# EAGLE design GrovePi-1.5 (EAGLE 6.3)
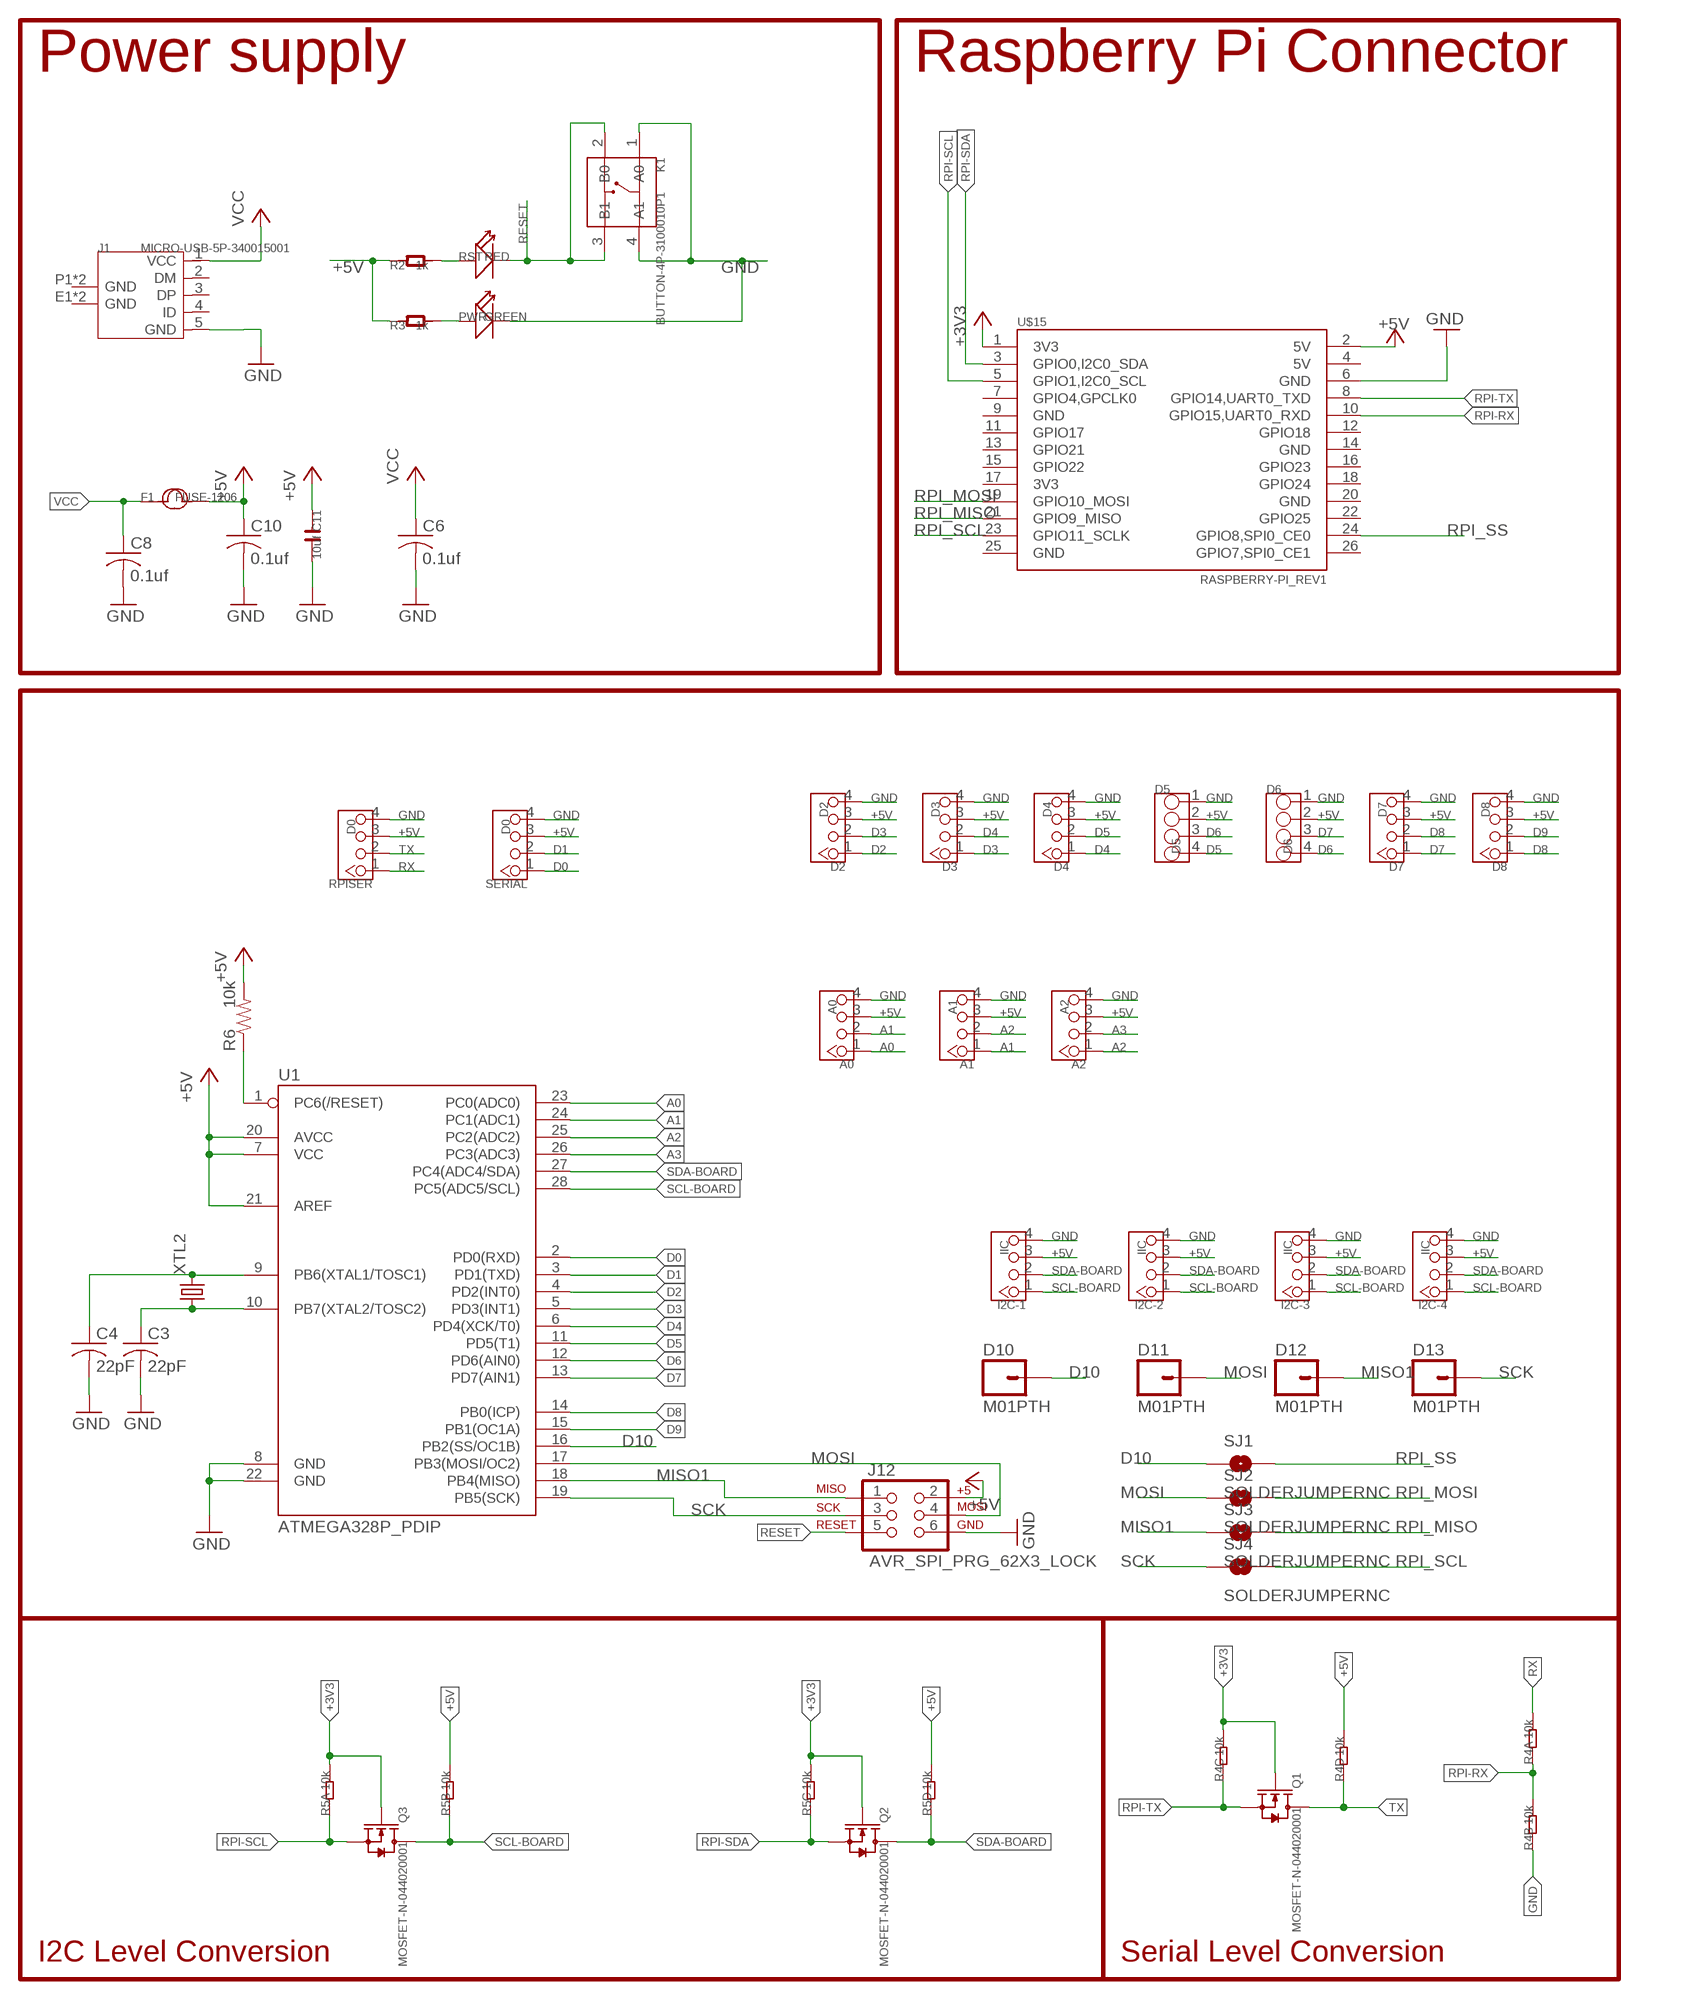
[diagram p0: schematic, sheet 1]

## Parts
A0  A0  TWIG-4P-2.0'90D'  [4P-2.0-90D]
A1  A1  TWIG-4P-2.0'90D'  [4P-2.0-90D]
A2  A2  TWIG-4P-2.0'90D'  [4P-2.0-90D]
C3  22pF  C-USC0603  [C0603]
C4  22pF  C-USC0603  [C0603]
C6  0.1uf  C-USC0603  [C0603]
C8  0.1uf  C-USC0603  [C0603]
C10  0.1uf  C-USC0603  [C0603]
C11  10uf  C-0805  [C0805]
D2  D2  TWIG-4P-2.0'90D'  [4P-2.0-90D]
D3  D3  TWIG-4P-2.0'90D'  [4P-2.0-90D]
D4  D4  TWIG-4P-2.0'90D'  [4P-2.0-90D]
D5  D5  GROVE-4P-2.0-3470130P1  [4P-2.0]
D6  D6  GROVE-4P-2.0-3470130P1  [4P-2.0]
D7  D7  TWIG-4P-2.0'90D'  [4P-2.0-90D]
D8  D8  TWIG-4P-2.0'90D'  [4P-2.0-90D]
D10  M01PTH  [1X01]
D11  M01PTH  [1X01]
D12  M01PTH  [1X01]
D13  M01PTH  [1X01]
F1  FUSE-1206  [F1206]
I2C-1  IIC  TWIG-4P-2.0'90D'  [4P-2.0-90D]
I2C-2  IIC  TWIG-4P-2.0'90D'  [4P-2.0-90D]
I2C-3  IIC  TWIG-4P-2.0'90D'  [4P-2.0-90D]
I2C-4  IIC  TWIG-4P-2.0'90D'  [4P-2.0-90D]
J1  MICRO-USB-5P-340015001  [B-SMD-5P]
J12  AVR_SPI_PRG_62X3_LOCK  [2X3_LOCK]
K1  BUTTON-4P-3100010P1  [4P-SMD-6.0X6.0X5.0H]
PWR  GREEN  LED  [LED0603]
Q1  MOSFET-N-044020001  [SOT23]
Q2  MOSFET-N-044020001  [SOT23]
Q3  MOSFET-N-044020001  [SOT23]
R2  1k  R-0603  [R0603]
R3  1k  R-0603  [R0603]
R4  10k  R-4R  [R1206-8]
R5  10k  R-4R  [R1206-8]
R6  10k  RESISTOR0603-RES  [0603]
RPISER  D0  TWIG-4P-2.0'90D'  [4P-2.0-90D]
RST  RED  LED  [LED0603]
SERIAL  D0  TWIG-4P-2.0'90D'  [4P-2.0-90D]
SJ1  SOLDERJUMPERNC  [SJ_2S]
SJ2  SOLDERJUMPERNC  [SJ_2S]
SJ3  SOLDERJUMPERNC  [SJ_2S]
SJ4  SOLDERJUMPERNC  [SJ_2S]
U1  ATMEGA328P_PDIP  [DIL28-3]
U$15  RASPBERRY-PI_REV1  [RASPBERRY-PI_REV1]
XTL2  CRYSTALHC49S  [HC49/S]

## Nets
+3V3: Q1.1(G) Q2.1(G) Q3.1(G) R4.6 R5.6 R5.8 U$15.1(3V3)
+5V: A0.3 A1.3 A2.3 C6.1 C10.1 C11.1 D2.3 D3.3 D4.3 D5.3 D6.3 D7.3 D8.3 F1.2 I2C-1.3 I2C-2.3 I2C-3.3 I2C-4.3 J12.2 R2.1 R3.1 R4.5 R5.5 R5.7 R6.2 RPISER.3 SERIAL.3 U1.7(VCC) U1.20(AVCC) U1.21(AREF) U$15.2(5V) ; supply symbol labelled VCC
A0: A0.1 U1.23(PC0(ADC0))
A1: A0.2 A1.1 U1.24(PC1(ADC1))
A2: A1.2 A2.1 U1.25(PC2(ADC2))
A3: A2.2 U1.26(PC3(ADC3))
D0: SERIAL.1 U1.2(PD0(RXD))
D1: SERIAL.2 U1.3(PD1(TXD))
D2: D2.1 U1.4(PD2(INT0))
D3: D2.2 D3.1 U1.5(PD3(INT1))
D4: D3.2 D4.1 U1.6(PD4(XCK/T0))
D5: D4.2 D5.1 U1.11(PD5(T1))
D6: D5.2 D6.1 U1.12(PD6(AIN0))
D7: D6.2 D7.1 U1.13(PD7(AIN1))
D8: D7.2 D8.1 U1.14(PB0(ICP))
D9: D8.2 U1.15(PB1(OC1A))
D10: D10.1 SJ1.1 U1.16(PB2(SS/OC1B))
GND: A0.4 A1.4 A2.4 C3.2 C4.2 C6.2 C8.2 C10.2 C11.2 D2.4 D3.4 D4.4 D5.4 D6.4 D7.4 D8.4 I2C-1.4 I2C-2.4 I2C-3.4 I2C-4.4 J1.5(GND) J12.6 K1.1(A0) K1.4(A1) PWR.- R4.2 RPISER.4 SERIAL.4 U1.8(GND) U1.22(GND) U$15.6(GND)
MISO1: D12.1 J12.1 SJ3.1 U1.18(PB4(MISO))
MOSI: D11.1 J12.4 SJ2.1 U1.17(PB3(MOSI/OC2))
N$1: C4.1 U1.9(PB6(XTAL1/TOSC1)) XTL2.2
N$2: PWR.+ R3.2
N$3: C3.1 U1.10(PB7(XTAL2/TOSC2)) XTL2.1
N$17: R2.2 RST.+
RESET: J12.5 K1.2(B0) K1.3(B1) R6.1 RST.- U1.1(PC6(/RESET))
RPI-RX: R4.1 R4.7 U$15.10(GPIO15,UART0_RXD)
RPI-SCL: Q3.2(S) R5.1 U$15.5(GPIO1,I2C0_SCL)
RPI-SDA: Q2.2(S) R5.3 U$15.3(GPIO0,I2C0_SDA)
RPI-TX: Q1.2(S) R4.3 U$15.8(GPIO14,UART0_TXD)
RPI_MISO: SJ3.2 U$15.21(GPIO9_MISO)
RPI_MOSI: SJ2.2 U$15.19(GPIO10_MOSI)
RPI_SCL: SJ4.2 U$15.23(GPIO11_SCLK)
RPI_SS: SJ1.2 U$15.24(GPIO8,SPI0_CE0)
RX: R4.8 RPISER.1
SCK: D13.1 J12.3 SJ4.1 U1.19(PB5(SCK))
SCL-BOARD: I2C-1.1 I2C-2.1 I2C-3.1 I2C-4.1 Q3.3(D) R5.2 U1.28(PC5(ADC5/SCL))
SDA-BOARD: I2C-1.2 I2C-2.2 I2C-3.2 I2C-4.2 Q2.3(D) R5.4 U1.27(PC4(ADC4/SDA))
TX: Q1.3(D) R4.4 RPISER.2
VCC: C8.1 F1.1 J1.1(VCC)
Unconnected: J1.2(DM) J1.3(DP) J1.4(ID) J1.E1(GND) J1.E2(GND) J1.P1(GND) J1.P2(GND) U$15.4(5V) U$15.7(GPIO4,GPCLK0) U$15.9(GND) U$15.11(GPIO17) U$15.12(GPIO18) U$15.13(GPIO21) U$15.14(GND) U$15.15(GPIO22) U$15.16(GPIO23) U$15.17(3V3) U$15.18(GPIO24) U$15.20(GND) U$15.22(GPIO25) U$15.25(GND) U$15.26(GPIO7,SPI0_CE1)

## Notes on the sheet
- Power supply | Raspberry Pi Connector
- I2C Level Conversion | Serial Level Conversion

## Library data of the parts
A0 A1 A2 D2-D4 D7 D8 I2C-1-I2C-4 RPISER SERIAL = Connector:TWIG-4P-2.0
C3 C4 C6 C8 C10 = rcl:C-US: CAPACITOR, American symbol
C11 = OPL:C*
D5 D6 = OPL Eagle Library:GROVE-4P-2.0
D10-D13 = SparkFun-Connectors:M01: Header 1 Standard 1-pin 0.1" header. Use with straight break away headers (SKU : PRT-00116), right angle break away headers (PRT-00553), swiss pins (PRT-00743), machine pins (PRT-00117), and female headers (PRT-00115).
F1 = OPL:FUSE*
J1 = OPL:MICRO-USB-5P: ST-USB-001E：MICRO USB B SMD R/A
J12 = zz My Parts:AVR_SPI_PRG_6: AVR ISP 6 Pin This is the reduced ISP connector for AVR programming. Common on Arduino. This footprint will take up less PCB space and can be used with a 10-pin to 6-pin adapter such as SKU: BOB-08508
K1 = OPL Eagle Library:BUTTON-4P
PWR RST = OPL:LED*: LED
Q1-Q3 = OPL:MOSFET-N: CJ2302：SMD MOSFET N-CH 20V-2.1A
R2 R3 = OPL:R*
R4 R5 = OPL:R-4R*: Resistor Array
R6 = zz My Parts:RESISTOR: Resistor Basic schematic elements and footprints for resistors. 0603 and 0805 are mine.
SJ1-SJ4 = SparkFun-Passives:SOLDERJUMPER: Solder Jumper Standard SMD solder jumper. Used to automate production. Two varients : Normally Open and Normally Closed are the same, but have different paste layers. NC will have a large amount of paste and should jumper during reflow.
U1 = SparkFun-DigitalIC:ATMEGA328P_PDIP: uC used in the Arduino 32kb flash, 1k EEPROM, 2k SRAM This is the through-hole version of this chip.
U$15 = RaspberryPi:RASPBERRY-PI_REV1: Raspberry Pi Board <http://www.raspberrypi.org/> Jacques Lagnel V1.0 (beta) 2012 Mateusz Bawaj V1.1 (beta) 2012 Board dimension: Forum 3D model <http://www.raspberrypi.org/forum/general-discussion/mechanical-profile-3d-models?value=3d%20model&type=1&include=1&search=1&ret=all> The GPIO Connector (P1): http://elinux.org/RPi_Low-level_peripherals
XTL2 = crystal:CRYSTAL: CRYSTAL; OC_FARNELL: 1667008; OC_NEWARK: unknown

## Board
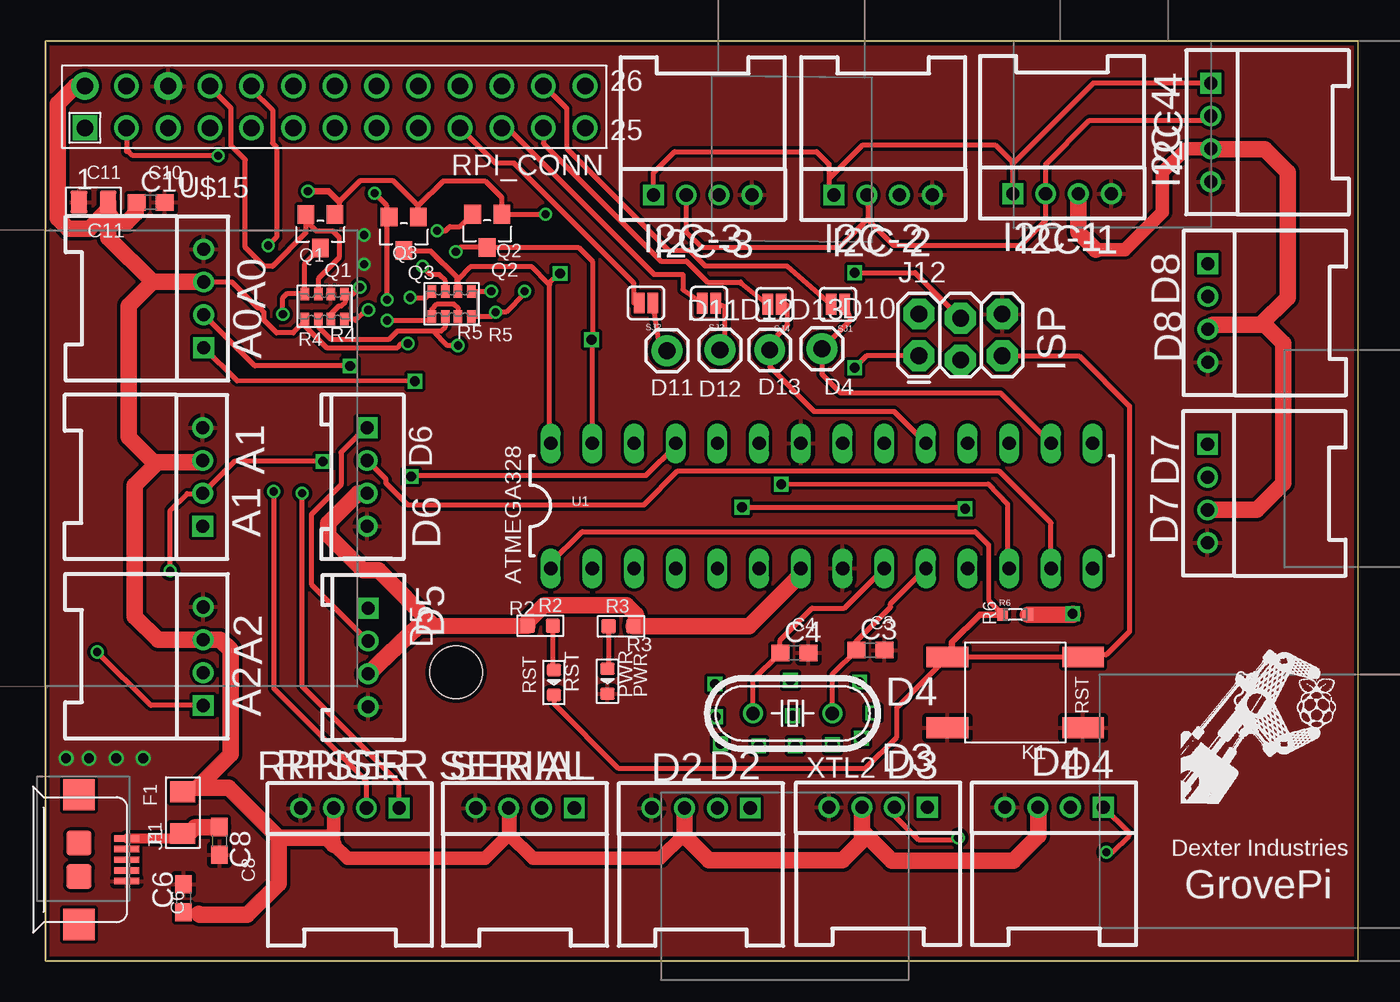
[diagram p1: board, top side]
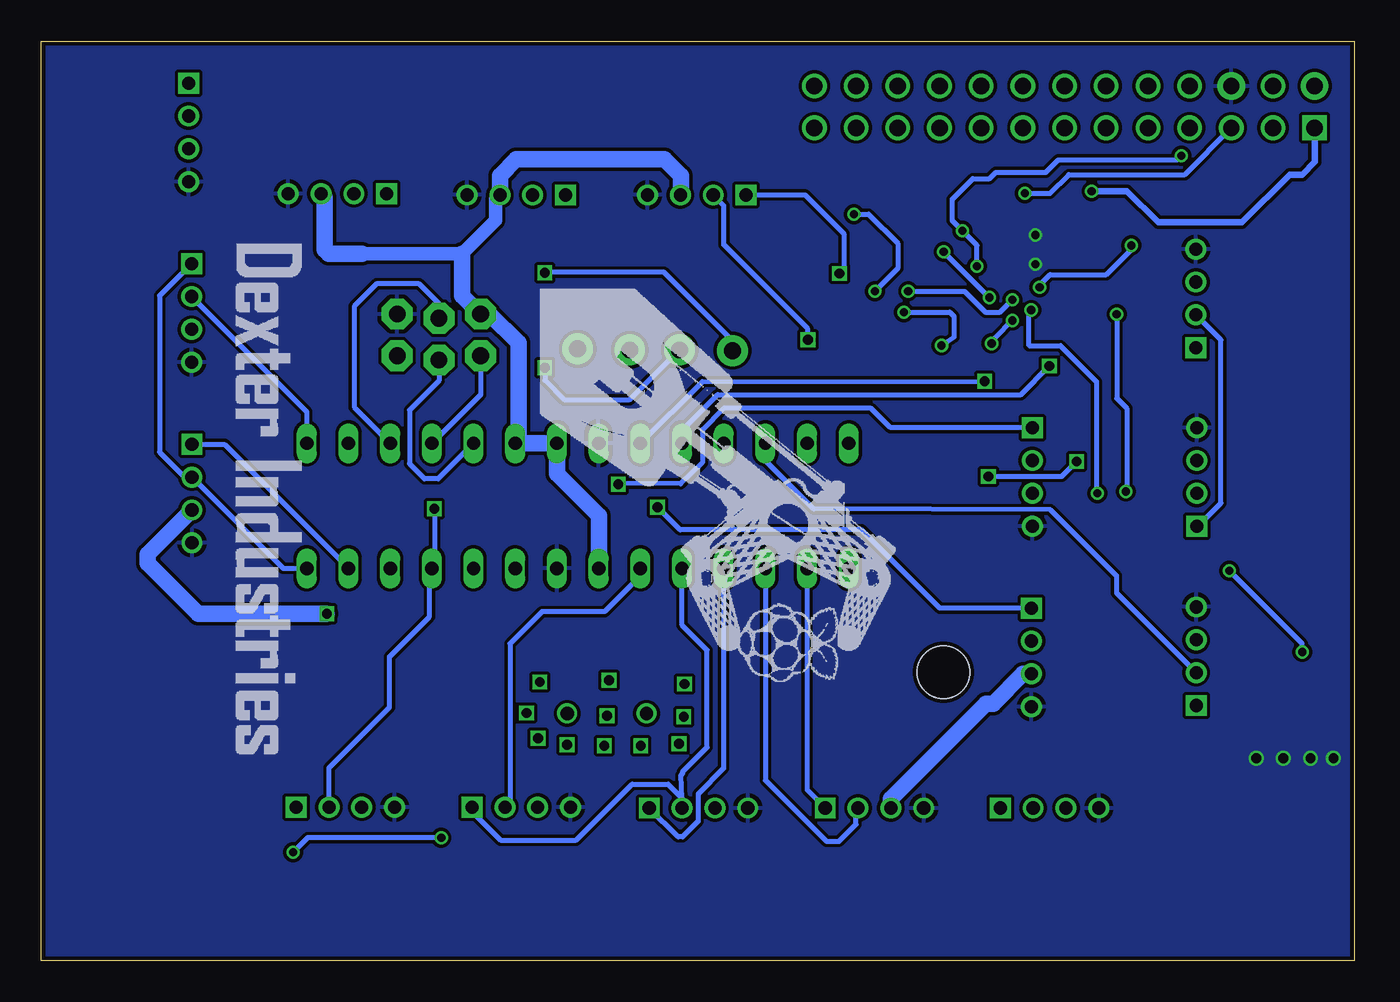
[diagram p2: board, bottom side, seen from below]

Size 80.01 x 56.01 mm. Coordinates in mm from the lower left corner, seen from the top.
Outline: 0,0 80.01,0 80.01,56.01 0,56.01 0,0
Copper layers (1*2*15*16): Top 0.035mm / dielectric 0.2mm / layer 2 0.0175mm / dielectric 1.1mm / layer 15 0.0175mm / dielectric 0.2mm / Bottom 0.035mm
Design rules "SeeedStudio_DRU_no_angle_20130527": minimum track width 6mil, minimum drill 12mil, track to track 6mil, track to pad 6mil, pad to pad 6mil, via to via 6mil, smd to smd 0mil, copper to edge 10mil, drill to drill 10mil, minimum pad ring 6mil, minimum via ring 6mil, stop-mask expansion 2mil, vias tented up to drill 25mil, thermal gap 10mil
Holes 3.2 mm at 25.02,17.57

### Footprints (pad centres in the part's own frame; a part is rotated, then mirrored left to right if it is on the bottom)
4P-2.0-90D = drill 0.8 pad 1.27 square: 1 -3,0 | drill 0.8 pad 1.27: 2 -1,0; 3 1,0; 4 3,0
C0603 = smd 1.1 x 1: 1 -0.85,0; 2 0.85,0
C0805 = smd 1.016 x 1.397: 1 -0.889,0; 2 0.889,0
4P-2.0 = drill 0.8 pad 1.27 square: 1 -3,0 | drill 0.8 pad 1.27: 2 -1,0; 3 1,0; 4 3,0
1X01 = drill 1.016 pad 1.88: 1 0,0
F1206 = smd 1.27 x 1.524: 1 -1.27,0; 2 1.27,0
B-SMD-5P = smd 0.38 x 1.52: 1 -1.3,2.54; 2 -0.65,2.54; 3 0,2.54; 4 0.65,2.54; 5 1.3,2.54 | smd 1.524 x 1.524: E1 -1.016,-0.381; E2 1.016,-0.381 | smd 1.9 x 1.9: P1 -3.95,-0.381; P2 3.95,-0.381
2X3_LOCK = drill 1.016 pad 1.88 octagon: 1 0,0; 2 0,2.54; 3 2.54,-0.254; 4 2.54,2.286; 5 5.08,0; 6 5.08,2.54
4P-SMD-6.0X6.0X5.0H = smd 2.54 x 1.27: 1 -4.129,2.159; 2 -4.129,-2.159; 3 4.129,-2.159; 4 4.129,2.159
LED0603 = smd 0.762 x 0.889: + -0.762,0; - 0.762,0
SOT23 = smd 1.016 x 1.143: 1 -0.889,-1.016; 2 0.889,-1.016; 3 0,1.016
R0603 = smd 0.889 x 0.889: 1 -0.762,0; 2 0.762,0
R1206-8 = smd 0.508 x 0.762: 1 -1.206,-0.762; 2 -0.381,-0.762; 3 0.381,-0.762; 4 1.206,-0.762; 5 1.206,0.762; 6 0.381,0.762; 7 -0.381,0.762; 8 -1.206,0.762
0603 = smd 0.635 x 0.762: 1 -0.762,0; 2 0.762,0
SJ_2S = smd 0.635 x 1.27: 1 -0.412,0; 2 0.412,0
DIL28-3 = drill 0.813 long: 1 -16.51,-3.81; 2 -13.97,-3.81; 3 -11.43,-3.81; 4 -8.89,-3.81; 5 -6.35,-3.81; 6 -3.81,-3.81; 7 -1.27,-3.81; 8 1.27,-3.81; 9 3.81,-3.81; 10 6.35,-3.81; 11 8.89,-3.81; 12 11.43,-3.81; 13 13.97,-3.81; 14 16.51,-3.81; 15 16.51,3.81; 16 13.97,3.81; 17 11.43,3.81; 18 8.89,3.81; 19 6.35,3.81; 20 3.81,3.81; 21 1.27,3.81; 22 -1.27,3.81; 23 -3.81,3.81; 24 -6.35,3.81; 25 -8.89,3.81; 26 -11.43,3.81; 27 -13.97,3.81; 28 -16.51,3.81
RASPBERRY-PI_REV1 = drill 1 square: 1 -41.91,21.59 | drill 1 pad 1.676: 2 -41.91,24.13; 6 -36.83,24.13 | drill 1: 3 -39.37,21.59; 4 -39.37,24.13; 5 -36.83,21.59; 7 -34.29,21.59; 8 -34.29,24.13; 9 -31.75,21.59; 10 -31.75,24.13; 11 -29.21,21.59; 12 -29.21,24.13; 13 -26.67,21.59; 14 -26.67,24.13; 15 -24.13,21.59; 16 -24.13,24.13; 17 -21.59,21.59; 18 -21.59,24.13; 19 -19.05,21.59; 20 -19.05,24.13; 21 -16.51,21.59; 22 -16.51,24.13; 23 -13.97,21.59; 24 -13.97,24.13; 25 -11.43,21.59; 26 -11.43,24.13
HC49/S = drill 0.813: 1 -2.413,0; 2 2.413,0

### Placement (x,y rotation side)
A0  9.65,40.34 90 top
A1  9.6,29.46 90 top
A2  9.63,18.54 90 top
C3  50.27,18.91 0 top
C4  45.65,18.74 0 top
C6  8.43,3.81 90 top
C8  10.62,7.29 270 top
C10  6.43,46.18 0 top
C11  2.95,46.2 180 top
D2  39.95,9.3 180 top
D3  50.75,9.35 180 top
D4  61.47,9.35 180 top
D5  19.67,18.47 270 top
D6  19.62,29.46 270 top
D7  70.82,28.45 270 top
D8  70.84,39.45 270 top
D10  47.32,37.26 0 top
D11  37.88,37.15 0 top
D12  41.11,37.2 0 top
D13  44.15,37.2 0 top
F1  8.38,9.02 90 top
I2C-1  61.95,46.71 0 top
I2C-2  51.05,46.63 0 top
I2C-3  40.06,46.63 0 top
I2C-4  71.02,50.44 270 top
J1  2.44,6.15 270 top
J12  53.23,36.84 0 top
K1  59.1,16.33 180 top
PWR  34.25,17.02 270 top
Q1  16.76,44.42 180 top
Q2  26.92,44.45 180 top
Q3  21.84,44.27 180 top
R2  30.16,20.4 0 top
R3  35.09,20.36 180 top
R4  17.02,39.85 180 top
R5  24.77,40.01 180 top
R6  59.1,21.08 0 top
RPISER  18.57,9.3 180 top
RST  30.99,16.94 270 top
SERIAL  29.24,9.3 180 top
SJ1  48.3,39.97 180 top
SJ2  36.6,40.06 180 top
SJ3  40.45,40.03 180 top
SJ4  44.42,39.97 180 top
U1  47.31,27.7 0 top
U$15  44.32,29.13 0 top
XTL2  45.54,15.06 180 top

### Tracks (layer width: path | path; a pad name or v marks a point on that pad's centre or on a via)
+3V3  (via drill 0.5)
  Top 0.305: 24.38,38.86 R5.6 24.38,38.61 24.13,38.35 23.62,38.35 | R5.8 27.18,39.24 v27.43,39.5 28.07,39.5 29.21,40.64 v29.21,40.77 | v30.48,45.47 Q2.1 27.81,46.48 26.8,47.5 24.26,47.5 22.73,45.97 | R4.6 16.64,38.61 17.4,37.85 20.95,37.85 21.46,38.35 23.62,38.35 | v25.15,37.47 24.51,37.47 23.62,38.35 | Q3.1 22.73,45.97 | 22.73,45.97 21.21,47.5 19.18,47.5 17.91,46.23 17.91,45.7 Q1.1
  Top 0.406: v16,46.86 17.27,46.86 17.91,46.23
  Bottom 0.305: v27.43,39.5 24.64,39.5 R5.6 24.38,37.97 v25.15,37.47 | v30.48,45.47 29.59,45.47 27.81,43.69 27.81,42.16 v29.21,40.77
  Bottom 0.406: U$15.1 2.41,48.64 3.17,47.88 3.94,47.88 6.86,44.96 11.94,44.96 13.84,46.86 v16,46.86
+5V  (via drill 0.5, 0.6)
  Top 0.305: R5.7 25.15,39.75 24.89,40.01 23.88,40.01 23.56,39.69 R5.5 23.3,38.99 v20.83,38.99 | A0.3 11.37,41.34 12.95,39.75 13.08,39.75 13.34,39.5 13.34,38.99 14.1,38.23 15.11,38.23 15.81,38.92 R4.5 15.81,38.67 17.14,37.34 21.46,37.34 21.72,37.59 v22.1,37.59
  Top 0.61: C6.1 9.34,2.86 | 10.92,10.54 F1.2 | 35.9,20.41 R3.1
  Top 0.813: RPISER.3 17.57,7.07 18.41,6.22 26.8,6.22 28.32,7.75 28.32,9.21 SERIAL.3 28.23,7.71 29.72,6.22 37.47,6.22 38.86,7.62 38.86,9.2 D2.3 | I2C-4.3 69.51,49.44 68.07,48.01 68.07,45.59 65.79,43.31 64.01,43.31
  Top 1.016: D7.3 73.8,27.45 75.44,29.08 75.44,37.59 74.3,38.73 74.04,38.73 | D8.3 71.13,38.73 74.04,38.73 | 74.04,38.73 75.69,40.39 75.69,48.01 74.3,49.4 71.06,49.4 I2C-4.3 | 6.73,30.23 5.46,28.96 5.46,20.95 6.87,19.54 A2.3 9.64,19.56 10.67,19.56 11.3,18.92 11.3,12.57 9.27,10.54 10.92,10.54 11.18,10.54 14.22,7.49 | 6.73,30.23 6.86,30.35 9.49,30.35 A1.3 | A0.3 6.54,41.34 | 6.54,41.34 5.08,39.88 5.08,31.88 6.73,30.23 | U$15.2 1.83,53.26 0.76,52.2 0.76,45.21 1.4,44.58 2.67,44.58 3.81,45.72 3.81,45.67 C11.1 3.83,45.59 | 3.83,45.59 3.83,44.04 6.54,41.34 | C10.1 5.51,45.52 4.95,44.96 4.32,44.96 4.06,45.21 3.83,45.59 | 14.22,7.49 17.14,7.49 17.57,7.07 | 14.22,7.49 14.22,4.7 12.32,2.79 9.4,2.79 9.34,2.86 | I2C-1.3 62.95,44.36 64.01,43.31 | D5.3 22.71,20.37 23.7,20.38 | 23.7,20.38 R2.1 29.4,20.65 30.39,21.64 35.42,21.64 35.99,21.07 35.99,20.5 R3.1 42.88,20.36 46.04,23.52 U1.7 | D6.3 19.07,28.46 17.23,26.63 17.23,25.89 19.36,23.77 20.3,23.77 23.7,20.38 | R6.2 62.6,21.08 v62.6,21.12 | D2.3 38.95,7.62 40.45,6.12 48.56,6.12 49.75,7.3 D3.3 49.75,7.91 51.59,6.07 58.98,6.07 60.5,7.59 60.5,9.31 D4.3
  Bottom 0.305: v22.1,37.59 21.84,37.97 v20.83,38.99
  Bottom 0.813: 60.45,43.05 54.36,43.05 52.32,45.09 52.32,46.36 I2C-2.3
  Bottom 1.016: 60.45,43.05 62.48,43.05 62.74,43.31 62.74,46.5 I2C-1.3 | 54.36,43.05 54.36,40.51 J12.2 52.68,39.38 50.93,37.63 50.93,31.7 U1.20 U1.21 48.58,29.67 46,27.09 46,23.93 U1.7 | SERIAL.3 28.23,9.87 22.45,15.65 22,15.65 20.18,17.47 D5.3 | v62.6,21.12 70.43,21.12 73.52,24.21 73.52,24.74 D7.3 | I2C-2.3 52.05,47.79 51.05,48.79 42.01,48.79 41.02,47.8 41.02,46.67 I2C-3.3
A0  (via drill 0.6)
  Top 0.305: v22.52,35.29 11.68,35.31 A0.1
  Bottom 0.305: U1.23 39.71,35.27 v22.52,35.29
A1  (via drill 0.6)
  Top 0.305: v18.57,36.22 12.77,36.22 A0.2
  Bottom 0.305: U1.24 40.96,32.31 38.79,34.48 20.31,34.48 v18.57,36.22 | A1.1 9.53,26.46 8.13,27.86 8.13,37.81 A0.2
A2  (via drill 0.5, 0.6)
  Top 0.305: A2.1 6.43,15.54 v3.17,18.8 | v7.62,23.75 7.62,27.43 8.64,28.45 9.59,28.45 A1.2 11.54,30.4 v16.92,30.4 | U1.25 38.42,31.37 36.59,29.54 22.34,29.54 v22.29,29.49
  Bottom 0.305: v3.17,18.8 3.17,19.3 v7.62,23.75 | v22.29,29.49 17.83,29.49 v16.92,30.4
A3
  Bottom 0.305: U1.26 35.88,30.44 32.94,27.51 18.58,27.47 18.52,27.47 14.49,23.44 14.49,22.41 A2.2
D0
  Bottom 0.305: U1.2 33.34,10.4 SERIAL.1
D1
  Bottom 0.305: U1.3 35.88,10.98 32.16,7.26 31.39,7.26 30.35,8.31 30.35,9.18 SERIAL.2
D2
  Bottom 0.305: U1.4 38.42,11.71 39.98,10.15 39.98,8.48 40.92,7.54 41.2,7.54 D2.1
D3
  Bottom 0.305: D2.2 40.95,9.91 | 40.95,9.91 41.03,11.28 40.92,11.39 40.92,11.51 39.43,12.99 39.43,18.91 40.95,20.43 U1.5 | D3.1 53.75,9.08 52.01,7.34 47.41,7.34 43.99,10.76 41.8,10.76 40.95,9.91
D4  (via drill 0.5)
  Top 0.305: D3.2 51.75,8.83 53.21,7.37 55.5,7.37 v55.63,7.49 | v64.64,6.6 65.02,6.6 66.04,7.62 66.04,7.78 D4.1
  Bottom 0.305: v55.63,7.49 63.75,7.49 v64.64,6.6 | U1.6 43.5,23.43 45.67,21.26 49.49,21.26 51.45,19.3 51.45,9.65 D3.2
D5  (via drill 0.6)
  Top 0.305: v42.44,27.61 55.96,27.61 v56.05,27.52
  Bottom 0.305: D4.2 62.47,11.74 58.78,15.43 58.78,18.52 56.34,20.95 56.34,23.75 U1.11 56.05,24.04 v56.05,27.52 | D5.1 25.25,21.47 30.02,26.24 41.07,26.24 v42.44,27.61
D6  (via drill 0.6)
  Top 0.305: v44.84,29.02 57.44,29.03 58.64,27.8 58.64,23.99 U1.12 | D6.1 19.52,32.46 18.02,30.96 18.02,28.98 16.2,27.16 16.2,22.93 D5.2
  Bottom 0.305: D6.1 28.26,32.46 29.44,33.64 38.42,33.64 39.71,32.35 39.71,30.33 41.05,29.05 44.81,29.07 v44.84,29.02
D7
  Top 0.305: U1.13 61.28,26.66 58.14,29.79 38.51,29.79 36.46,27.75 22.1,27.75 20.77,29.08 20.77,29.32 D6.2
  Bottom 0.305: D7.1 68.84,31.45 U1.13
D8
  Bottom 0.305: U1.14 65.26,23.89 D7.2 71.26,29.45 72.78,30.98 72.78,40.5 D8.1
D9
  Bottom 0.305: D8.2 63.82,33.42 U1.15
D10
  Top 0.305: U1.16 58.2,34.58 48.46,34.58 47.32,35.73 D10.1 49.06,39 SJ1.1
GND  (via drill 0.5, 0.6)
  Top 0.305: U1.22 46.04,31.66
  other vias: 1.27,12.32 2.67,12.32 4.32,12.32 5.97,12.32 19.43,44.2 19.43,42.42
  pour Top (isolate 0.203): 0,56.01 80.01,56.01 80.01,0 0,0
  pour Bottom (isolate 0.203): 0,56.01 80.01,56.01 80.01,0 0,0
MISO1  (via drill 0.6)
  Top 0.305: D12.1 41.41,37.5 41.41,39.83 SJ3.1 | J12.1 50.05,36.84 v49.31,36.11
  Bottom 0.305: J12.1 53.23,34.48 U1.18 | v49.31,36.11 49.31,35.34 48.13,34.16 44.15,34.16 D12.1
MOSI  (via drill 0.6)
  Top 0.305: 37.97,37.23 D11.1 37.36,37.67 SJ2.1 | v49.31,41.9 53,41.9 J12.4
  Bottom 0.305: J12.4 55.77,40.01 56.97,41.21 59.58,41.21 60.94,39.85 60.94,33.71 U1.17 | D11.1 37.88,37.76 42.06,41.94 49.28,41.94 v49.31,41.9
N$1
  Top 0.305: XTL2.2 43.12,17.1 C4.1 44.77,19.5 46.72,21.46 48.69,21.46 U1.9
N$2
  Top 0.305: R3.2 34.33,17.86 PWR.+
N$3
  Top 0.305: XTL2.1 47.95,17.47 C3.1 49.39,19.41 51.5,21.53 51.5,21.73 U1.10
N$5  (via drill 0.6)
  other vias: 40.81,16.85
N$6  (via drill 0.6)
  other vias: 40.86,14.86
N$7  (via drill 0.6)
  other vias: 41.14,13.21
N$8  (via drill 0.6)
  other vias: 43.47,13.09
N$9  (via drill 0.6)
  other vias: 45.69,13.09
N$11  (via drill 0.6)
  other vias: 45.52,14.92
N$12  (via drill 0.6)
  other vias: 45.42,17.08
N$13  (via drill 0.6)
  other vias: 47.97,13.16
N$15  (via drill 0.6)
  other vias: 49.73,13.55
N$16  (via drill 0.6)
  other vias: 50.42,15.09
N$17
  Top 0.305: R2.2 30.92,17.77 RST.+
N$18  (via drill 0.6)
  other vias: 49.62,16.97
RESET
  Top 0.305: J12.5 62.99,36.84 66.06,33.77 66.06,20.04 64.64,18.62 63.35,18.62 K1.2 K1.3 51.88,15.4 51.88,13.61 49.99,11.72 34.9,11.72 30.99,15.63 RST.- | U1.1 30.8,24.22 32.72,26.14 56.67,26.14 57.47,25.34 57.47,21.95 R6.1
  Top 0.406: R6.1 56.93,21.08 55.24,19.39 55.24,18.77 K1.3
RPI-RX  (via drill 0.5)
  Top 0.305: R4.7 17.4,39.37 17.91,39.88 18.03,39.88 18.29,40.13 18.29,40.55 R4.1 18.77,40.62 v19.18,41.02 | U$15.10 12.57,53.09 13.84,51.82 13.84,49.78 14.1,49.53 14.1,44.07 v13.59,43.56
  Bottom 0.305: v19.18,41.02 19.18,41.15 18.54,41.78 15.11,41.78 13.59,43.31 v13.59,43.56
RPI-SCL  (via drill 0.5)
  Top 0.305: R5.1 v27.18,40.77 | v20.83,40.26 20.83,45.16 | 20.83,45.16 Q3.2 | 20.83,45.16 20.83,45.97 v20.07,46.74
  Bottom 0.305: v27.18,40.77 23.75,40.77 22.48,39.5 21.59,39.5 v20.83,40.26 | v20.07,46.74 18.54,46.74 17.4,47.88 10.34,47.88 U$15.5
RPI-SDA  (via drill 0.5)
  Top 0.305: R5.3 24.38,41.4 24,41.78 23.5,41.78 v22.99,42.29 | Q2.2 25.27,44.7 24.64,44.7 24.38,44.45 v23.88,44.45 | U$15.3 4.95,49.4 | 4.95,49.4 4.95,49.28 | v10.54,49.02 5.33,49.02 4.95,49.4
  Bottom 0.305: v22.99,42.29 22.99,43.56 v23.88,44.45 24.51,45.09 24.51,46.35 23.24,47.62 22.23,47.62 21.84,48.01 18.8,48.01 18.03,48.77 10.79,48.77 v10.54,49.02
RPI-TX
  Top 0.305: R4.3 16.64,41.53 17.91,42.8 17.91,44.07 17.53,44.45 16.51,44.45 15.88,45.09 Q1.2 15.88,44.32 13.84,42.29 13.34,42.29 12.19,43.43 12.19,48.77 11.3,49.66 11.3,51.94 10.03,53.21 U$15.8
RPI_MISO
  Top 0.305: U$15.21 28.16,50.72 37.08,41.8 38.86,41.8 38.86,40.86 SJ3.2
RPI_MOSI
  Top 0.305: U$15.19 27.41,48.59 28.57,48.59 28.57,48.56 35.85,41.27 35.85,40.07 SJ2.2
RPI_SCL
  Top 0.305: U$15.23 30.35,49.76 37.5,42.61 39.06,42.61 40.35,41.33 42.39,41.33 42.39,41.24 SJ4.2
RPI_SS
  Top 0.305: U$15.24 30.42,53.26 31.77,51.91 31.77,49.48 37.99,43.27 39.26,43.27 40.21,42.32 45.19,42.32 SJ1.2
RX  (via drill 0.5)
  Top 0.305: R4.8 18.82,39.09 18.92,38.99 19.56,39.62 v19.68,39.62 | RPISER.1 21.57,10.8 15.65,16.73 v15.65,28.47
  Bottom 0.305: v19.68,39.62 19.81,39.5 19.81,37.47 17.91,37.47 15.71,35.27 15.71,28.54 v15.65,28.47
SCK
  Top 0.305: U1.19 51.72,33.45 46.85,33.45 44.15,36.16 D13.1 44.62,37.67 44.62,38.09 45.24,38.71 45.24,39.92 SJ4.1
  Bottom 0.305: J12.3 55.77,35.33 57.57,33.53 57.57,30.26 56.66,29.35 55.82,29.35 U1.19 | U1.19
SCL-BOARD  (via drill 0.6)
  Top 0.305: I2C-3.1 37.06,47.98 38.35,49.28 46.99,49.28 47.75,48.51 47.75,47.62 | 47.75,47.62 47.75,46.94 I2C-2.1 | I2C-4.1 63.86,53.44 58.93,48.51 | 58.93,48.51 58.93,46.73 I2C-1.1 | 58.93,48.51 58.93,48.64 57.91,49.66 49.78,49.66 47.75,47.62 | U1.28 30.73,31.51 30.73,41.17 30.68,41.23 | 30.68,41.23 29.65,42.25 25.89,42.25 25.15,41.5 R5.2 arc-90 25.09,40.82 25.09,41.62 23.5,43.22 21.88,43.22 Q3.3 | v31.36,41.85 31.29,41.85 30.68,41.23
  Bottom 0.305: I2C-3.1 33.47,46.63 31.1,44.27 31.1,42.1 v31.36,41.85
SDA-BOARD  (via drill 0.5, 0.6)
  Top 0.305: I2C-3.2 39.06,44.38 40.01,43.43 48.39,43.43 50.16,45.21 | 50.16,45.21 50.16,46.52 I2C-2.2 | 50.16,45.21 50.16,45.09 51.69,43.56 59.44,43.56 60.96,45.09 I2C-1.2 60.95,48.51 63.63,51.18 70.75,51.18 I2C-4.2 | v25.02,43.18 25.27,43.43 Q2.3 32.49,43.43 33.34,42.58 33.34,37.86 v33.29,37.81 33.34,37.76 U1.27 | v22.23,40.39 23.18,40.39 R5.4
  Bottom 0.305: v25.02,43.18 v22.23,40.39 | v33.29,37.81 33.29,38.48 38.41,43.6 38.41,45.98 I2C-3.2
TX  (via drill 0.5)
  Top 0.305: Q1.3 15.81,42.46 R4.4 14.71,40.62 14.48,40.39 v14.48,39.37 | v13.92,28.57 13.92,16.59 19.56,10.95 19.56,9.31 RPISER.2
  Bottom 0.305: v14.48,39.37 14.48,34.24 13.87,33.63 13.87,28.63 v13.92,28.57
VCC
  Top 0.61: J1.1 8.38,7.45 F1.1
  Top 1.016: F1.1 8.76,7.75 9.14,8.13 10.56,8.13 C8.1

### Text on the board
tPlace: I2C-4 | RPI_CONN | C11 | C10 | I2C-3 | I2C-2 | I2C-1 | Q1 | Q3 | Q2 | A0 | ISP | D8 | R5 | R4 | D12 | D13 | D4 | D11 | ATMEGA328 | A1 | D7 | D6 | R2 | R3 | C4 | C3 | D5 | R6 | A2 | D4 | RST | RST | PWR | SERIAL | D3 | F1 | RPISER | D2 | D4 | C8 | Dexter Industries | GrovePi | C6